# Altium schematic sheet PG15_ Fuel Gauge.SchDoc
size B
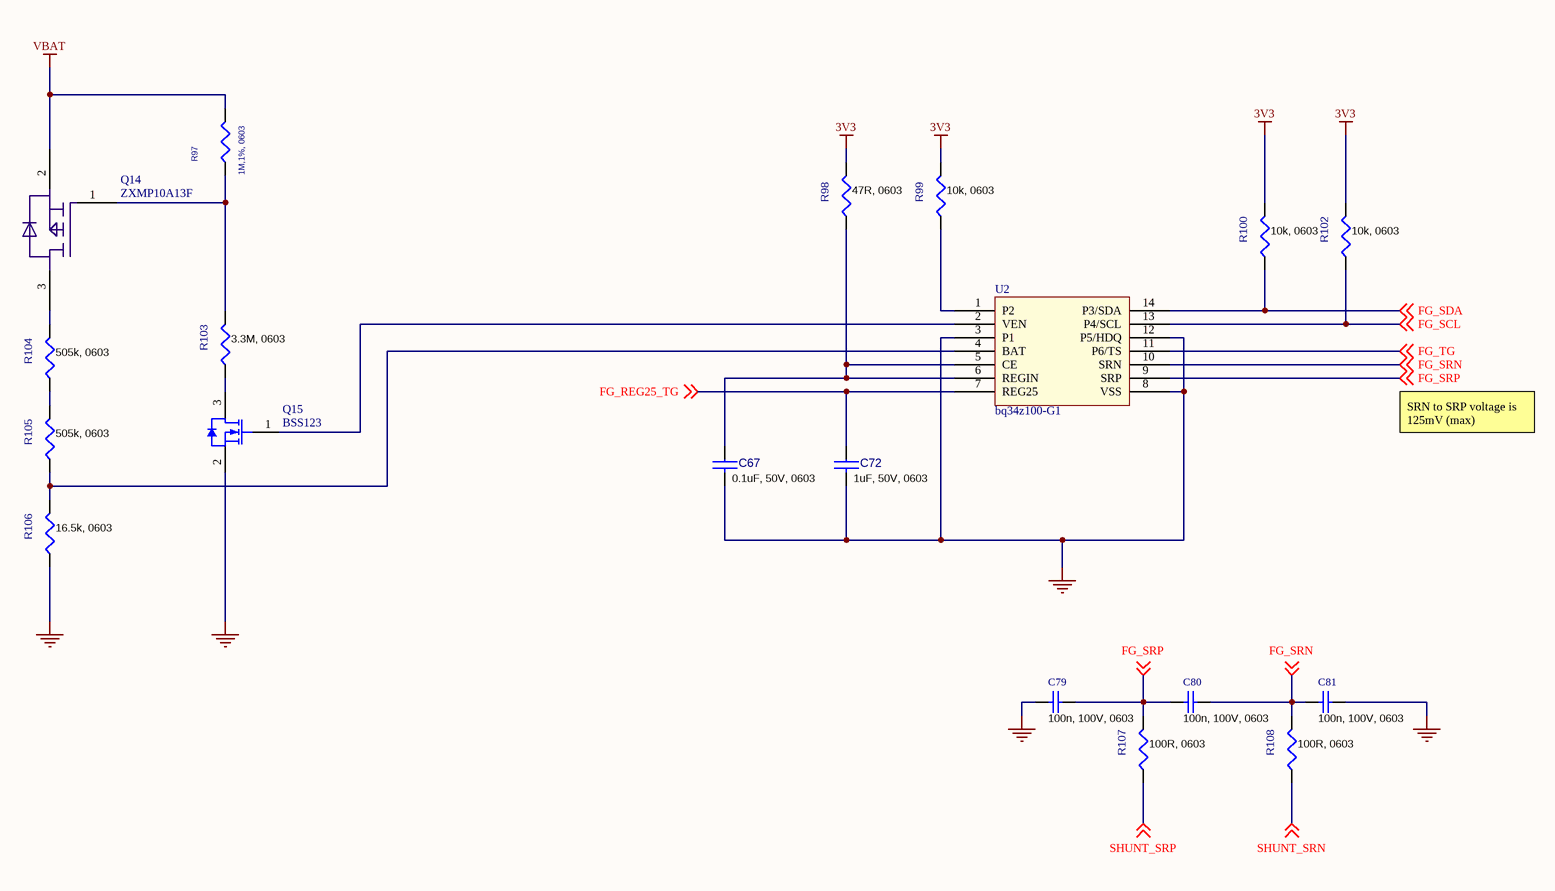
[diagram p0: PG15_ Fuel Gauge.SchDoc]

## Parts
C67  0.1uF, 50V, 0603  [C0603]
C72  1uF, 50V, 0603  [C0603]
C79  100n, 100V, 0603  [C0603]
C80  100n, 100V, 0603  [C0603]
C81  100n, 100V, 0603  [C0603]
Q14  ZXMP10A13F  [SOT90P240X110-3N - ZXMP10A13F]
Q15  BSS123  [FAIR-SOT23-3_V]
R97  1M,1%, 0603  [R0603]
R98  47R, 0603  [R0603]
R99  10k, 0603  [R0603]
R100  10k, 0603  [R0603]
R102  10k, 0603  [R0603]
R103  3.3M, 0603  [R0603]
R104  505k, 0603  [R0603]
R105  505k, 0603  [R0603]
R106  16.5k, 0603  [R0603]
R107  100R, 0603  [R0603]
R108  100R, 0603  [R0603]
U2  bq34z100-G1  [PW14]

## Nets
3V3: R98.2 R99.2 R100.2 R102.2
GND: C67.2 C72.2 C79.2 C81.1 Q15.2(S) R106.1 U2.3(P1) U2.8(VSS) U2.12(P5/HDQ)
VBAT: Q14.2(S) R97.2
FG_REG25_TG: C72.1 U2.7(REG25) ; off-sheet FG_REG25_TG
FG_SCL: R102.1 U2.13(P4/SCL) ; off-sheet FG_SCL
FG_SDA: R100.1 U2.14(P3/SDA) ; off-sheet FG_SDA
FG_SRN: C80.1 C81.2 R108.2 U2.10(SRN) ; off-sheet FG_SRN
FG_SRP: C79.1 C80.2 R107.2 U2.9(SRP) ; off-sheet FG_SRP
FG_TG: U2.11(P6/TS) ; off-sheet FG_TG
SHUNT_SRN: R108.1 ; off-sheet SHUNT_SRN
SHUNT_SRP: R107.1 ; off-sheet SHUNT_SRP
NetC67_1: C67.1 R98.1 U2.5(CE) U2.6(REGIN)
NetQ14_1: Q14.1(G) R97.1 R103.2
NetQ14_3: Q14.3(D) R104.2
NetQ15_1: Q15.1(G) U2.2(VEN)
NetQ15_3: Q15.3(D) R103.1
NetR99_1: R99.1 U2.1(P2)
NetR104_1: R104.1 R105.2
NetR105_1: R105.1 R106.2 U2.4(BAT)

## Notes on the sheet
- SRN to SRP voltage is 125mV (max)
- Title
- Size:
- Date:
- B
- Number:
- Time:
- Revision:
- Sheet
- of
- MATTERNET
- 161 E. Evelyn Ave.
- Mountain View,
- CA 94041 USA
- PROPRIETRY & CONFIDENTIAL
  THE INFORMATION CONTAINS IN THIS DRAWING
  IS THE SOLE PROPERTY OF  MATTERNET Inc.
  ANY REPRODUCTION IN PART OR AS WHOLE
  WITHOUT A WRITTEN PERMISSION OF
  MATTERNET Inc. IS PROHIBITED
- File:

## Library data of the parts
C67 = CAP-Generic-0603: CAP CER 0.1UF 50V 10% X7R 0603; Manufacturer: Murata; Manufacturer Part Number: GCJ188R71E104KA12D; Supplier 1: Digi-Key; Supplier Part Number 1: 490-16477-1-ND; Stock 1: 2560; Pricing 1: 1=0.22, 10=0.152, 100=0.077, 500=0.0527, 1000=0.04662 (USD); Case/Package: 0603; Supplier 2: Mouser; Supplier Part Number 2: 81-GCJ188R71E104KA2D; Stock 2: 47905; Pricing 2: 1=0.21, 10=0.139, 50=0.139, 100=0.071, 1000=0.043, 10000=0.035 (USD)
C72 = CAP-Generic-0603: CAP CER 1UF 50V 10% X7R 0603
C79-C81 = Cap: CAP CER 100n 100V X7R 0603; Manufacturer: Murata; Manufacturer Part Number: GCJ188R72A104KA01D; Capacitance: 100nF; Tolerance: 10%; Supplier 1: Digi-Key; Supplier Part Number 1: 490-13420-1-ND; Stock 1: 224293; Pricing 1: 1=0.28, 10=0.189, 100=0.1073, 500=0.07578, 1000=0.0663 (USD); Mount: Surface Mount; Case/Package: 0603; Case Code (Metric): 1608; Case Code (Imperial): 0603; Min Operating Temperature: -55°C; Max Operating Temperature: 125°C; Packaging: Tape and Reel; Voltage Rating: 100V; Features: Soft Termination; Length: 0.063inch; Width: 0.031inch; Thickness: 0.035inch; Ratings: AEC-Q200; Lead Free: Lead Free; Supplier 2: Mouser; Supplier Part Number 2: 81-GCJ188R72A104KA1D; Stock 2: 680575; Pricing 2: 1=0.26, 10=0.173, 50=0.173, 100=0.099, 1000=0.061, 10000=0.05 (USD)
Q14 = ZXMP10A13F: 100V P-CHANNEL ENHANCEMENT MODE MOSFET; Supplier 1: Digi-Key; ComponentLink1Description: Datasheet; ComponentLink1URL: https://www.diodes.com/assets/Datasheets/ZXMP10A13F.pdf; Supplier Part Number 1: ZXMP10A13FCT-ND
Q15 = CMP-2000-04934-1: N-Channel Logic Level Enhancement Mode Field Effect Transistor, 1.7 V, -55 to 150 degC, 3-Pin SOT-23, RoHS, Tape and Reel; Manufacturer: Fairchild; Channel Type: N; Typical Turn-Off Delay Time: 17ns; Maximum Continuous Drain Current: 0.17A; Rad Hard: No; Typical Rise Time: 9ns; Typical Fall Time: 2.4ns; Maximum Gate Source Voltage: ±20V; Maximum Drain Source Voltage: 100V; Typical Turn-On Delay Time: 1.7ns; RDS-on: 6000@10VmOhm; Package Version: Rev. 12, 03/2016; Packaging: Tape&Reel; Package Reference: SOT23-3; Channel Mode: Enhancement; Operating Temperature: -55to150degC; Package Description: 3-Pin Small Outline Transistor, Body 2.92 x 1.325 mm, Pitch 0.95 mm; Category: MOSFET; Datasheet Version: Jun-03; Datasheet URL: https://www.fairchildsemi.com/datasheets/BS/BSS123.pdf; Manufacturer URL: https://www.fairchildsemi.com/; Mounting: SurfaceMount; Package: 3SOT-23; Package URL: http://www.fairchildsemi.com/dwg/MA/MA03D.pdf
R97 = R-Generic-0603: custprt: 100-0110-000153; custinv: Ansync; Option: AB
R98 = R-Generic-0603: RES SMD 47R OHM 1% 1/10W 0603
R99 R100 R102 = R-Generic-0603: RES SMD 10k OHM 1% 1/10W 0603
R103 = R-Generic-0603: RES SMD 3.3M OHM 1% 1/10W 0603
R104 R105 = R-Generic-0603: RES SMD 505k OHM 1% 1/10W 0603
R106 = R-Generic-0603: RES SMD 16.5k OHM 1% 1/10W 0603
R107 R108 = R-Generic-0603: RES SMD 100R OHM 1% 1/10W 0603
U2 = bq34z100-G1: Wide Range Fuel Gauge with Impedance Track™ Technology; Manufacturer 1: Texas Instruments; Manufacturer Part Number 1: BQ34Z100PWR-G1; Operating Supply Voltage: 4.5V; Interface: I2C; Supplier 1: Digi-Key; RoHS: Yes; Category: Battery Management; Stock 1: 18187; Pricing 1: 1=4.08000, 10=3.66500, 25=3.46520, 100=2.84900, 250=2.55640, 500=2.46400, 1000=2.04820 (USD); Mount: Surface Mount; Case/Package: TSSOP; Number of Pins: 14; Weight: 0.004949oz; Contact Plating: Gold; Min Operating Temperature: -40°C; Max Operating Temperature: 85°C; Package Quantity: 2000; Packaging: Tape and Reel; Lead Free: Lead Free; ComponentLink1URL: http://www.ti.com/lit/ds/symlink/bq34z100-g1.pdf?src-supplier=Digi-Key; ComponentLink1Description: http://www.ti.com/lit/ds/symlink/bq34z100-g1.pdf?src-supplier=Digi-Key; ComponentLink2URL: http://www.ti.com/general/docs/lit/getliterature.tsp?genericPartNumber=BQ34Z100-G1&&fileType=pdf&src-supplier=Avnet; ComponentLink2Description: http://www.ti.com/general/docs/lit/getliterature.tsp?genericPartNumber=BQ34Z100-G1&&fileType=pdf&src-supplier=Avnet; ComponentLink3URL: http://www.ti.com/lit/gpn/bq34z100-g1?src-supplier=Mouser; ComponentLink3Description: http://www.ti.com/lit/gpn/bq34z100-g1?src-supplier=Mouser; Supplier 2: Mouser; Manufacturer 2: Texas Instruments; Manufacturer Part Number 2: BQ34Z100PWR-G1; Stock 2: 14027; Pricing 2: 1=4.09000, 10=3.67000, 25=3.47000, 100=2.85000, 250=2.56000, 500=2.47000 (USD); Supplier Part Number 1: 296-39949-1-ND; Supplier Part Number 2: 595-BQ34Z100PWR-G1; ComponentLink4Description: Datasheet; ComponentLink4URL: https://www.ti.com/lit/ds/symlink/bq34z100-g1.pdf?&ts=1589205881092; ComponentLink5Description: EVM Manual; ComponentLink5URL: http://www.ti.com/lit/ug/sluu904a/sluu904a.pdf?&ts=1589277756655; ComponentLink6Description: Tech Ref Manual; ComponentLink6URL: https://www.ti.com/lit/ug/sluubw5/sluubw5.pdf?&ts=1589205888955